# Altium schematic sheet Sheet1.SchDoc
size A4
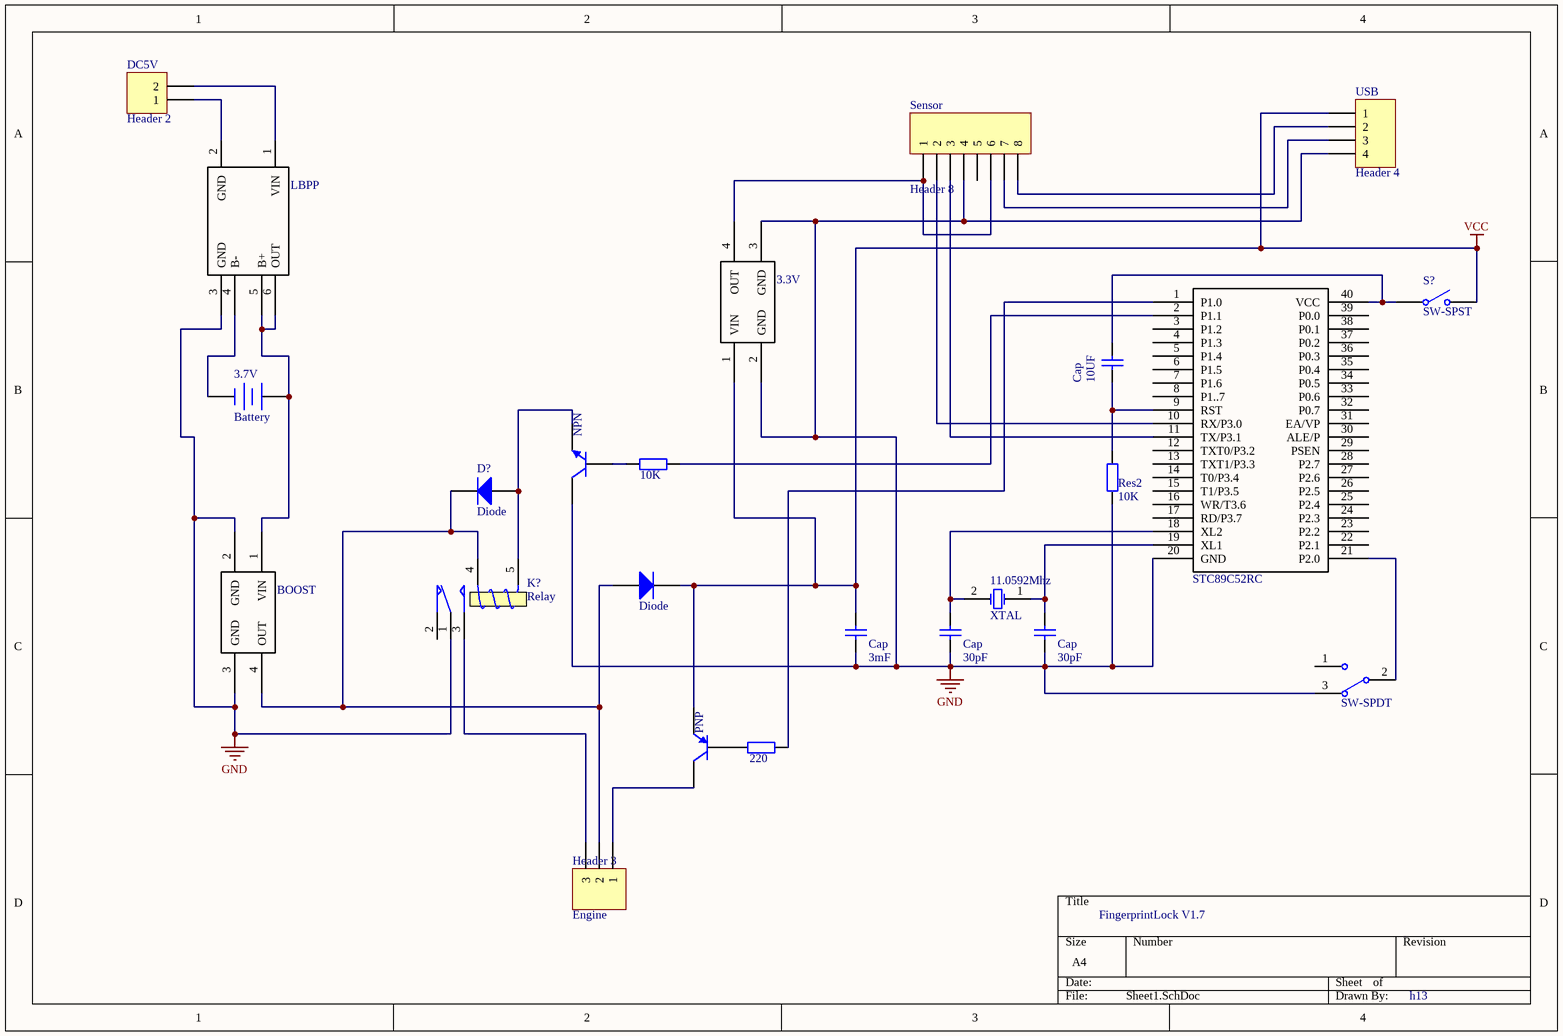
[diagram p0: Sheet1.SchDoc]

## Parts
(Parts that share a designator on the sheet are numbered #1, #2 ... from top to bottom, then left to right.)
3.7V  Battery  [BAT-2]
11.0592Mhz  XTAL  [R38]
*#1  LBPP
*#2  3.3V
*#3  STC89C52RC
*#4  BOOST
C?#1  Cap  value 10UF  [RAD-0.3]
C?#2  Cap  value 3mF  [RAD-0.3]
C?#3  Cap  value 30pF  [RAD-0.3]
C?#4  Cap  value 30pF  [RAD-0.3]
D?#1  Diode  [SMC]
D?#2  Diode  [SMC]
DC5V  Header 2  [HDR1X2]
Engine  Header 3  [HDR1X3]
K?  Relay  [MODULE5B]
Q?#1  NPN  [TO-226-AA]
Q?#2  PNP  [SOT-23B_N]
R?#1  value 10K  [AXIAL-0.4]  (hidden comment: Res2)
R?#2  Res2  value 10K  [AXIAL-0.4]
R?#3  220  [AXIAL-0.4]
S?#1  SW-SPST  [SPST-2]
S?#2  SW-SPDT  [TL36WW15050]
Sensor  Header 8  [HDR1X8]
USB  Header 4  [HDR1X4]

## Nets
GND: *#1.3(GND) *#2.2(GND) *#2.3(GND) *#3.20(GND) *#4.2(GND) *#4.3(GND) C?#2.1 C?#3.1 C?#4.1 K?.1(COM) Q?#1.1(C) R?#2.1 S?#2.3 Sensor.4 USB.4
VCC: *#2.1(VIN) C?#2.2 D?#2.2(K) Q?#2.3(E) S?#1.2(NO) USB.1
Net3.7V_1: 3.7V.1(+) *#1.5(B+) *#1.6(OUT) *#4.1(VIN)
Net3.7V_2: 3.7V.2(-) *#1.4(B-)
Net11.0592Mhz_1: 11.0592Mhz.1(OSC1) *#3.19(XL1) C?#4.2
Net11.0592Mhz_2: 11.0592Mhz.2(OSC2) *#3.18(XL2) C?#3.2
Net*#1_1: *#1.1(VIN) DC5V.2
Net*#1_2: *#1.2(GND) DC5V.1
Net*#2_4: *#2.4(OUT) Sensor.1 Sensor.6
Net*#3_1: *#3.1(P1.0) R?#3.2
Net*#3_2: *#3.2(P1.1) R?#1.2
Net*#3_9: *#3.9(RST) C?#1.1 R?#2.2
Net*#3_10: *#3.10(RX/P3.0) Sensor.2
Net*#3_11: *#3.11(TX/P3.1) Sensor.3
Net*#3_21: *#3.21(P2.0) S?#2.2
Net*#3_40: *#3.40(VCC) C?#1.2 S?#1.1(COMMON)
Net*#4_4: *#4.4(OUT) D?#1.2(K) D?#2.1(A) Engine.2 K?.4(T1)
NetD?#1_1: D?#1.1(A) K?.5(T2) Q?#1.3(E)
NetEngine_1: Engine.1 Q?#2.1(C)
NetEngine_3: Engine.3 K?.3(NO)
NetQ?#1_2: Q?#1.2(B) R?#1.1
NetQ?#2_2: Q?#2.2(B) R?#3.1
NetSensor_7: Sensor.7 USB.3
NetSensor_8: Sensor.8 USB.2

Not connected (* = marked no-connect by the designer): *#3 3(P1.2) 4(P1.3) 5(P1.4) 6(P1.5) 7(P1.6) 8(P1..7) 12(TXT0/P3.2) 13(TXT1/P3.3) 14(T0/P3.4) 15(T1/P3.5) 16(WR/T3.6) 17(RD/P3.7) 22(P2.1) 23(P2.2) 24(P2.3) 25(P2.4) 26(P2.5) 27(P2.6) 28(P2.7) 29(PSEN) 30(ALE/P) 31(EA/VP) 32(P0.7) 33(P0.6) 34(P0.5) 35(P0.4) 36(P0.3) 37(P0.2) 38(P0.1) 39(P0.0); K? 2(NC); S?#2 1; Sensor 5

## Notes on the sheet
- FingerprintLock V1.7
- h13

## Library data of the parts
3.7V = Battery: Multicell Battery; Published: 24-Mar-1999; LatestRevisionDate: 17-Jul-2002; LatestRevisionNote: Re-released for DXP Platform.; PackageReference: BAT-2; Publisher: Altium Limited; PackageDescription: Battery; 2 Leads
11.0592Mhz = XTAL: Crystal Oscillator; Published: 8-Jun-2000; LatestRevisionDate: 17-Jul-2002; LatestRevisionNote: Re-released for DXP Platform.; PackageReference: R38; Publisher: Altium Limited; PackageDescription: Crystal, Thru-Hole; 2 Leads; Body 3.1 x 8.2 mm (Dia.xH)
C?#1-C?#4 = Cap: Capacitor; Published: 8-Jun-2000; LatestRevisionDate: 17-Jul-2002; LatestRevisionNote: Re-released for DXP Platform.; PackageReference: RAD-0.3; Publisher: Altium Limited; PackageDescription: Radial Cap, Thru-Hole; 2 Leads; 0.3 in Pin Spacing
D?#1 D?#2 = Diode: Default Diode; Published: 8-Jun-2000; LatestRevisionDate: 17-Jul-2002; LatestRevisionNote: Re-released for DXP Platform.; PackageVersion: Sep-1996; PackageReference: SMC; Publisher: Altium Limited; PackageDescription: DO-214-AB/SMC; 2 C-Bend Leads; Body 7.9 x 5.9 mm, inc. leads (LxW); Code_JEDEC: DO-214-AB
DC5V = Header 2: Header, 2-Pin; LatestRevisionDate: 17-Jul-2002; LatestRevisionNote: Re-released for DXP Platform.; Publisher: Altium Limited
Engine = Header 3: Header, 3-Pin; LatestRevisionDate: 17-Jul-2002; LatestRevisionNote: Re-released for DXP Platform.; Publisher: Altium Limited
K? = Relay: SPDT Relay; Published: 8-Jun-2000; LatestRevisionDate: 17-Jul-2002; LatestRevisionNote: Re-released for DXP Platform.; PackageReference: MODULE5B; Publisher: Altium Limited
Q?#1 = NPN: NPN Bipolar Transistor; Published: 8-Jun-2000; LatestRevisionDate: 17-Jul-2002; LatestRevisionNote: Re-released for DXP Platform.; PackageReference: TO-226-AA; Publisher: Altium Limited; PackageDescription: TO, Flat Index; 3 In-Line, Axial Leads; Body Dia. 4.8mm; Leads 0.55 x 0.51 mm (max); Code_JEDEC: TO-226-AA
Q?#2 = PNP: PNP Bipolar Transistor; Published: 8-Jun-2000; LatestRevisionDate: 29-May-2009; LatestRevisionNote: IPC-7351 Footprint Added.; PackageVersion: Aug-1999; PackageReference: SOT-23B; Publisher: Altium Limited; PackageDescription: 3-Pin SOT-23 Package 0.95 mm Pitch, 2.4 mm Lead Span
R?#1-R?#3 = Res2: Resistor; Published: 8-Jun-2000; LatestRevisionDate: 17-Jul-2002; LatestRevisionNote: Re-released for DXP Platform.; PackageReference: AXIAL-0.4; Publisher: Altium Limited; PackageDescription: Axial Device, Thru-Hole; 2 Leads; 0.4 in Pin Spacing
  R?#3: Value: 220
S?#1 = SW-SPST: Single-Pole, Single-Throw Switch; Published: 24-Mar-1999; LatestRevisionDate: 17-Jul-2002; LatestRevisionNote: Re-released for DXP Platform.; PackageReference: SPST-2; Publisher: Altium Limited; PackageDescription: Switch; 2 Leads
S?#2 = SW-SPDT: SPDT Subminiature Toggle Switch, Right Angle Mounting, Vertical Actuation; Published: 24-Mar-1999; LatestRevisionDate: 17-Dec-2003; LatestRevisionNote: Schematic revised, PCB Footprint replaced.; DatasheetVersion: 05-Dec-2000; PackageReference: TL36WW15050; Publisher: Altium Limited; PackageDescription: Switch; 4 Leads; ComponentLink1Description: Manufacturer Link; ComponentLink1URL: http://www.apem.com
Sensor = Header 8: Header, 8-Pin; LatestRevisionDate: 17-Jul-2002; LatestRevisionNote: Re-released for DXP Platform.; Publisher: Altium Limited
USB = Header 4: Header, 4-Pin; LatestRevisionDate: 17-Jul-2002; LatestRevisionNote: Re-released for DXP Platform.; Publisher: Altium Limited